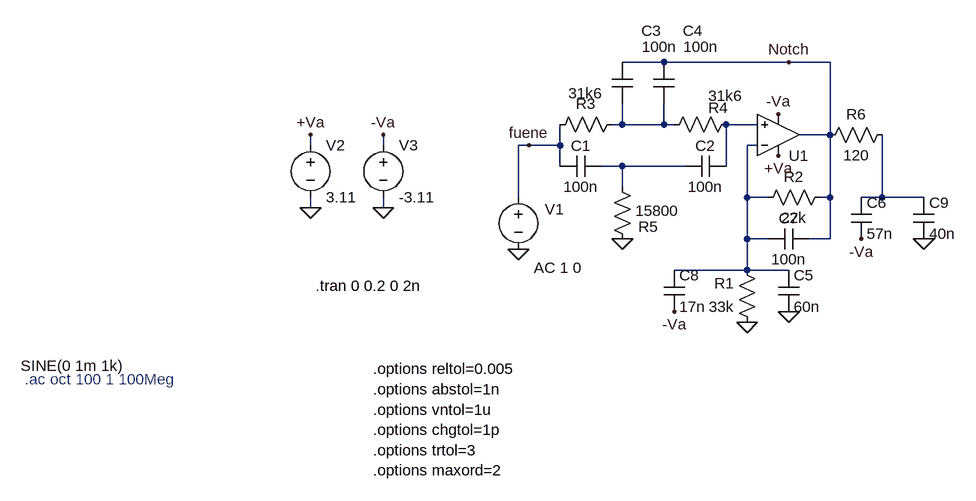
[diagram p0: schematic Prueba_Correcciones_Notch.asc]
Prueba_Correcciones_Notch.asc, the LTspice schematic file:
Version 4
SHEET 1 880 772
WIRE 128 16 64 16
WIRE 320 16 128 16
WIRE 384 16 320 16
WIRE 64 112 64 80
WIRE 64 112 48 112
WIRE 128 112 128 80
WIRE 128 112 64 112
WIRE 144 112 128 112
WIRE 272 112 224 112
WIRE 384 128 384 16
WIRE 384 128 336 128
WIRE -416 144 -416 128
WIRE -304 144 -304 128
WIRE -80 144 -96 144
WIRE -32 144 -32 112
WIRE -32 144 -80 144
WIRE 272 144 256 144
WIRE -32 176 -32 144
WIRE 64 176 32 176
WIRE 160 176 64 176
WIRE 224 176 224 112
WIRE 64 208 64 176
WIRE -96 224 -96 144
WIRE 256 224 256 144
WIRE 288 224 256 224
WIRE 384 224 384 128
WIRE 384 224 368 224
WIRE 464 224 464 128
WIRE 464 224 432 224
WIRE 528 224 464 224
WIRE -416 240 -416 224
WIRE -304 240 -304 224
WIRE 256 288 256 224
WIRE 288 288 256 288
WIRE 384 288 384 224
WIRE 384 288 352 288
WIRE 256 336 256 288
WIRE 256 336 144 336
WIRE 320 336 256 336
FLAG 256 416 0
FLAG 304 96 -Va
FLAG 304 160 +Va
FLAG 320 16 Notch
FLAG 64 288 0
FLAG -96 304 0
FLAG -80 144 fuene
FLAG -416 128 +Va
FLAG -416 240 0
FLAG -304 128 -Va
FLAG -304 240 0
FLAG 320 400 0
FLAG 528 288 0
FLAG 144 400 -Va
FLAG 432 288 -Va
SYMBOL OpAmps\\UniversalOpAmp2 304 128 M180
SYMATTR InstName U1
SYMBOL res 272 432 R180
WINDOW 0 36 76 Left 2
WINDOW 3 36 40 Left 2
SYMATTR InstName R1
SYMATTR Value 33k
SYMBOL res 384 208 R90
WINDOW 0 0 56 VBottom 2
WINDOW 3 32 56 VTop 2
SYMATTR InstName R2
SYMATTR Value 22k
SYMBOL res 64 96 R90
WINDOW 0 0 56 VBottom 2
WINDOW 3 -48 57 VTop 2
SYMATTR InstName R3
SYMATTR Value 31k6
SYMBOL res 240 96 R90
WINDOW 0 6 28 VBottom 2
WINDOW 3 -44 17 VTop 2
SYMATTR InstName R4
SYMATTR Value 31k6
SYMBOL cap 32 160 R90
WINDOW 0 0 32 VBottom 2
WINDOW 3 32 32 VTop 2
SYMATTR InstName C1
SYMATTR Value 100n
SYMBOL cap 224 160 R90
WINDOW 0 0 32 VBottom 2
WINDOW 3 32 32 VTop 2
SYMATTR InstName C2
SYMATTR Value 100n
SYMBOL cap 48 16 R0
WINDOW 3 46 -24 Left 2
WINDOW 0 45 -48 Left 2
SYMATTR Value 100n
SYMATTR InstName C3
SYMBOL res 48 192 R0
WINDOW 0 41 77 Left 2
WINDOW 3 36 53 Left 2
SYMATTR InstName R5
SYMATTR Value 15800
SYMBOL cap 112 16 R0
WINDOW 3 46 -24 Left 2
WINDOW 0 45 -48 Left 2
SYMATTR Value 100n
SYMATTR InstName C4
SYMBOL voltage -96 208 R0
WINDOW 0 41 34 Left 2
WINDOW 123 24 124 Left 2
WINDOW 39 0 0 Left 0
WINDOW 3 -766 275 Left 2
SYMATTR InstName V1
SYMATTR Value2 AC 1 0
SYMATTR Value SINE(0 1m 1k)
SYMBOL voltage -416 128 R0
WINDOW 123 0 0 Left 2
WINDOW 39 0 0 Left 2
SYMATTR InstName V2
SYMATTR Value 3.11
SYMBOL voltage -304 128 R0
WINDOW 123 24 146 Left 2
WINDOW 39 24 125 Left 2
SYMATTR InstName V3
SYMATTR Value -3.11
SYMBOL cap 304 336 R0
SYMATTR InstName C5
SYMATTR Value 60n
SYMBOL cap 416 224 R0
SYMATTR InstName C6
SYMATTR Value 57n
SYMBOL cap 352 272 R90
WINDOW 0 0 32 VBottom 2
WINDOW 3 32 32 VTop 2
SYMATTR InstName C7
SYMATTR Value 100n
SYMBOL cap 128 336 R0
SYMATTR InstName C8
SYMATTR Value 17n
SYMBOL cap 512 224 R0
SYMATTR InstName C9
SYMATTR Value 40n
SYMBOL res 480 112 R90
WINDOW 0 0 56 VBottom 2
WINDOW 3 32 56 VTop 2
SYMATTR InstName R6
SYMATTR Value 120
TEXT -856 504 Left 2 ;.ac oct 100 1 100Meg
TEXT -320 488 Left 2 !.options reltol=0.005\n.options abstol=1n\n.options vntol=1u\n.options chgtol=1p\n.options trtol=3\n.options maxord=2
TEXT -408 360 Left 2 !.tran 0 0.2 0 2n

The netlist it stands for:
* Prueba_Correcciones_Notch.asc
XU1 N002 N003 +Va -Va Notch level2 Avol=1Meg GBW=10Meg Slew=10Meg Ilimit=25m Rail=0 Vos=0 En=0 Enk=0 In=0 Ink=0 Rin=500Meg  ; pins In+ In- V+ V- OUT
R1 0 N003 33k
R2 Notch N003 22k
R3 N001 fuene 31k6
R4 N002 N001 31k6
C1 N004 fuene 100n
C2 N002 N004 100n
C3 Notch N001 100n
R5 N004 0 15800
C4 Notch N001 100n
V1 fuene 0 SINE(0 1m 1k) AC 1 0
V2 +Va 0 3.11
V3 -Va 0 -3.11
C5 N003 0 60n
C6 N005 -Va 57n
C7 Notch N003 100n
C8 N003 -Va 17n
C9 N005 0 40n
R6 N005 Notch 120
* .ac oct 100 1 100Meg
.options reltol=0.005
.options abstol=1n
.options vntol=1u
.options chgtol=1p
.options trtol=3
.options maxord=2
.tran 0 0.2 0 2n
.lib UniversalOpAmp2.lib
.backanno
.end